# Altium schematic sheet ZooidPeripherals.SchDoc
size A4
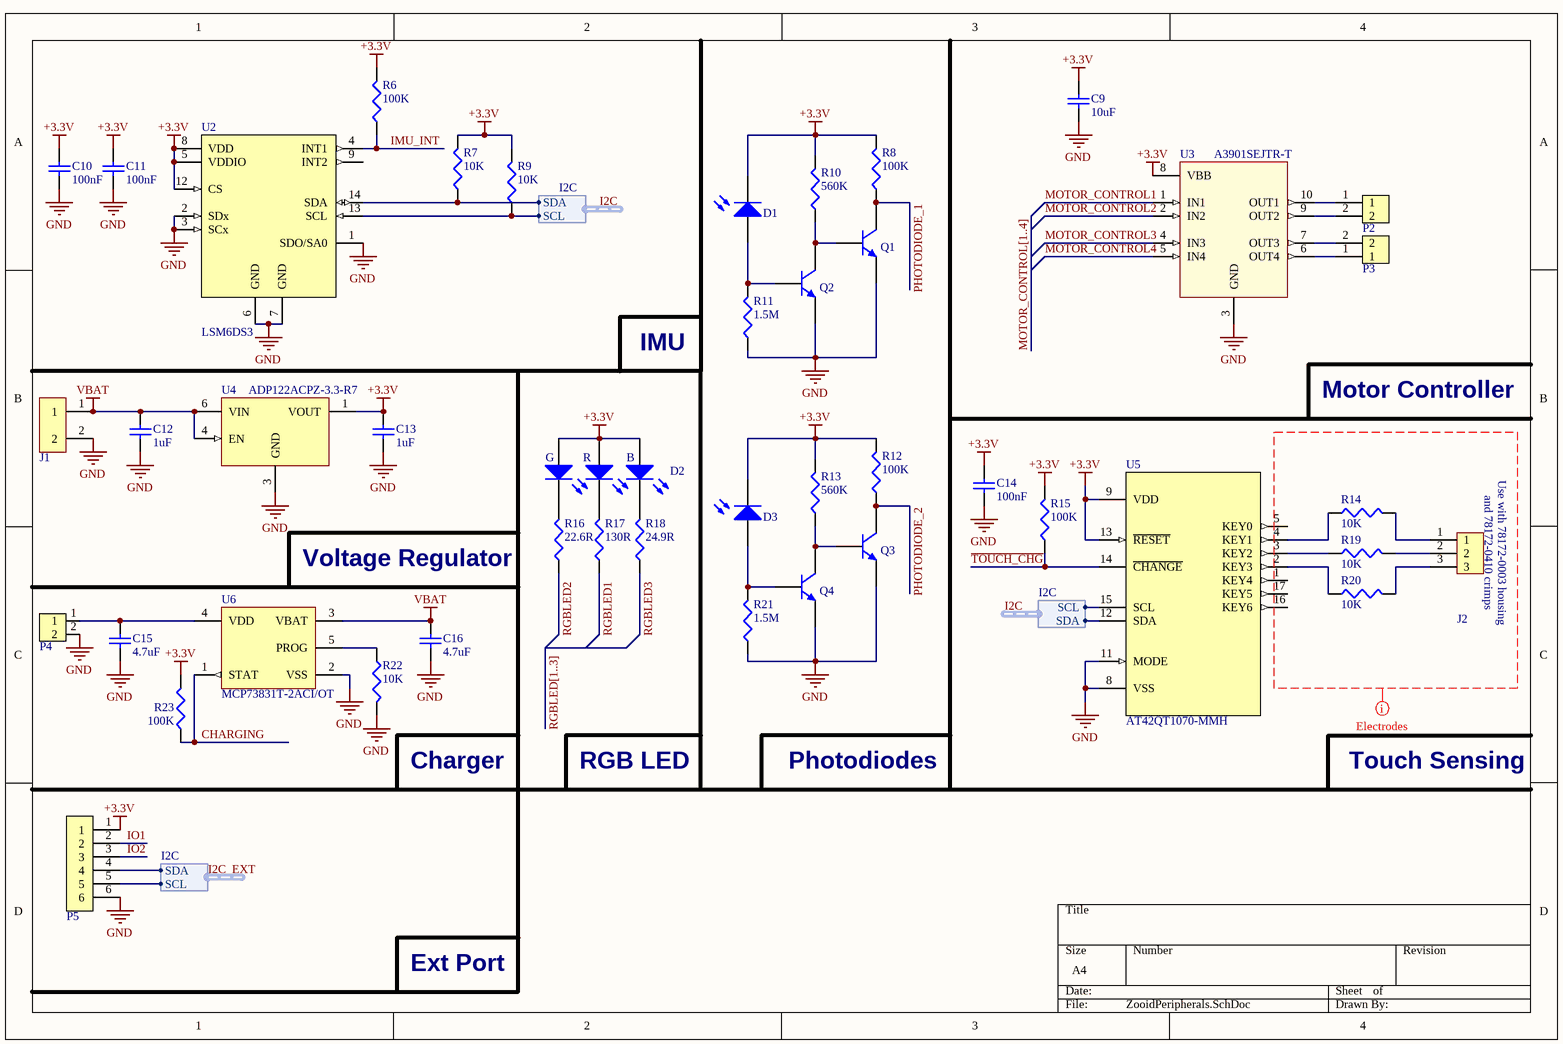
[diagram p0: ZooidPeripherals.SchDoc]

## Parts
C9  10uF  [0603]
C10  100nF  [0402]
C11  100nF  [0402]
C12  1uF  [0603]
C13  1uF  [0603]
C14  100nF  [0402]
C15  4.7uF  [0603]
C16  4.7uF  [0603]
D1  PD15-22C/TR8  [PD15-22C/TR8]  (value not drawn)
D2  SMLVN6RGB1W1  [3.5x2.8 mm 6-SMD]  (value not drawn)
D3  PD15-22C/TR8  [PD15-22C/TR8]  (value not drawn)
J1  78171-0002  [78171-0002]  (value not drawn)
J2  78171-0003  [78171-0003]  (value not drawn)
P2  HEADER 2X1 0.05" UNPOLARIZED  [HEADER 2X1 0.05" - UNPOLARIZED]  (value not drawn)
P3  HEADER 2X1 0.05" UNPOLARIZED  [HEADER 2X1 0.05" - UNPOLARIZED]  (value not drawn)
P4  CHARGING PAD  [Charging Pad]  (value not drawn)
P5  EXTENSION_PORT  [EXTENSION_PORT]  (value not drawn)
Q1  MMBT3904L  [SOT23_L]  (value not drawn)
Q2  MMBT3904L  [SOT23_L]  (value not drawn)
Q3  MMBT3904L  [SOT23_L]  (value not drawn)
Q4  MMBT3904L  [SOT23_L]  (value not drawn)
R6  100K  [0402]
R7  10K  [0402]
R8  100K  [0402]
R9  10K  [0402]
R10  560K  [0402]
R11  1.5M  [0402]
R12  100K  [0402]
R13  560K  [0402]
R14  10K  [0402]
R15  100K  [0402]
R16  22.6R  [0402]
R17  130R  [0402]
R18  24.9R  [0402]
R19  10K  [0402]
R20  10K  [0402]
R21  1.5M  [0402]
R22  10K  [0402]
R23  100K  [0402]
U2  LSM6DS3  [LGA-14 2.5x3x0.86 mm 14L]
U3  A3901SEJTR-T  [DFN50P300X300X75_HS-11N]
U4  ADP122ACPZ-3.3-R7  [LFCSP-6 2.0X2.0X0.55]
U5  AT42QT1070-MMH  [QFN45P300X300X85_HS-21L]
U6  MCP73831T-2ACI/OT  [SOT-23-OT5_L]

## Harnesses
I2C: SDA, SCL

## Nets
+3.3V: C9.2 C10.2 C11.2 C13.2 C14.2 D1.2(K) D2.1(AB) D2.2(AR) D2.3(AG) D3.2(K) P5.1 R6.2 R7.2 R8.2 R9.2 R10.2 R12.2 R13.2 R15.2 R23.2 U2.5(VDDIO) U2.8(VDD) U2.12(CS) U3.8(VBB) U4.1(VOUT) U5.9(VDD) U5.13(~{RESET})
GND: C9.1 C10.1 C11.1 C12.1 C13.1 C14.1 C15.1 C16.1 J1.2 P4.2 P5.6 Q1.2(E) Q2.2(E) Q3.2(E) Q4.2(E) R11.1 R21.1 R22.2 U2.1(SDO/SA0) U2.2(SDx) U2.3(SCx) U2.6(GND) U2.7(GND) U3.3(GND) U3.11(PAD) U4.2(NC) U4.3(GND) U4.5(NC) U4.7(THPAD) U5.8(VSS) U5.11(MODE) U5.21(PAD) U6.2(VSS)
VBAT: C12.2 C16.2 J1.1 U4.4(EN) U4.6(VIN) U6.3(VBAT)
CHARGING: R23.1 U6.1(STAT)
I2C.SCL: R9.1 U2.13(SCL) U5.15(SCL) ; harness I2C.SCL
I2C.SDA: R7.1 U2.14(SDA) U5.12(SDA) ; harness I2C.SDA
I2C_EXT.SCL: P5.5 ; harness I2C.SCL
I2C_EXT.SDA: P5.4 ; harness I2C.SDA
IMU_INT: R6.1 U2.4(INT1)
IO1: P5.2
IO2: P5.3
MOTOR_CONTROL1: U3.1(IN1)
MOTOR_CONTROL2: U3.2(IN2)
MOTOR_CONTROL3: U3.4(IN3)
MOTOR_CONTROL4: U3.5(IN4)
PHOTODIODE_1: Q1.3(C) R8.1
PHOTODIODE_2: Q3.3(C) R12.1
RGBLED1: R17.1
RGBLED2: R16.1
RGBLED3: R18.1
~{TOUCH_CHG}: R15.1 U5.14(~{CHANGE})
NetC15_2: C15.2 P4.1 U6.4(VDD)
NetD1_1: D1.1(A) Q2.1(B) R11.2
NetD2_4: D2.4(KG) R16.2
NetD2_5: D2.5(KR) R17.2
NetD2_6: D2.6(KB) R18.2
NetD3_1: D3.1(A) Q4.1(B) R21.2
NetJ2_1: J2.1 R14.2
NetJ2_2: J2.2 R19.2
NetJ2_3: J2.3 R20.2
NetP2_1: P2.1 U3.10(OUT1)
NetP2_2: P2.2 U3.9(OUT2)
NetP3_1: P3.1 U3.6(OUT4)
NetP3_2: P3.2 U3.7(OUT3)
NetQ1_1: Q1.1(B) Q2.3(C) R10.1
NetQ3_1: Q3.1(B) Q4.3(C) R13.1
NetR14_1: R14.1 U5.4(KEY1)
NetR19_1: R19.1 U5.3(KEY2)
NetR20_1: R20.1 U5.2(KEY3)
NetR22_1: R22.1 U6.5(PROG)

Not connected (* = marked no-connect by the designer): U2 9(INT2) 10(OCS) 11(NC); U5 1(KEY4) 5(KEY0) 6(NC) 7(NC) 10(NC) 16(KEY6) 17(KEY5) 18(NC) 19(NC) 20(NC)

## Buses and harness runs
bus MOTOR_CONTROL[1..4]
bus RGBLED[1..3]

## Layout directives
net class Electrodes: (no net found under the mark)

## Notes on the sheet
- IMU
- Motor Controller
- Voltage Regulator
- Charger
- RGB LED
- Photodiodes
- Touch Sensing
- Ext Port
- (in symbol 78171-0003) and 78172-0410 crimps; Use with 78172-0003 housing
- (in symbol SMLVN6RGB1W1) G; R; B

## Library data of the parts
C9 = 10uF: 10uF 0603 X5R 6.3V ±20%; Supplier 1: Farnell; Supplier Part Number 1: 2456110; Supplier 2: Digi-Key; Supplier Part Number 2: 490-10475-1-ND; Value: 10uF
C10 C11 C14 = 100nF: 100nF 0402 X7R 16V ±10%; Supplier 1: Farnell; Supplier Part Number 1: 1288252; Supplier 2: Digi-Key; Supplier Part Number 2: 399-3521-1-ND; Value: 100nF
C12 C13 = 1uF: 1uF 0603 X5R 10V ±10%; Supplier 1: Farnell; Supplier Part Number 1: 1759399; Supplier 2: Digi-Key; Supplier Part Number 2: 478-1251-1-ND; Value: 1uF
C15 C16 = 4.7uF: 4.7uF 0603 X5R 10V ±10%; Supplier 1: Farnell; Supplier Part Number 1: 2362098; Supplier 2: Digi-Key; Supplier Part Number 2: 445-5170-1-ND; Value: 4.7uF
D1 D3 = PD15-22C/TR8: Everlight PD15-22C/TR8 Silicon PIN Photodiode; Supplier 1: Digi-Key; Supplier Part Number 1: 1080-1367-1-ND
D2 = SMLVN6RGB1W1: ROHM SMLVN6RGB1W1 LED Tri-Color Blue/Green/Red Chip LED 6-Pin 1411 T/RLED Tri-Color Blue/Green/Red Chip LED 6-Pin 1411; Supplier 1: Mouser; Supplier 2: Digi-Key; Supplier Part Number 1: 755-SMLVN6RGB1W1; Supplier Part Number 2: 846-1187-1-ND
J1 = 78171-0002: Molex Pico-EZmate™ Wire-to-Board Header, 2 contacts; Supplier 1: Farnell; Supplier 2: Digi-Key; Supplier Part Number 1: 2313710; Supplier Part Number 2: WM4459CT-ND
J2 = 78171-0003: Molex Pico-EZmate™ Wire-to-Board Header, 3 contacts; Supplier 1: Farnell; Supplier 2: Digi-Key; Supplier Part Number 1: 2313562; Supplier Part Number 2: WM5409CT-ND
Q1-Q4 = MMBT3904L: On Semiconductor MMBT3904L General Purpose Transistor  NPN Silicon; Supplier 1: Farnell; Supplier 2: Digi-Key; Supplier Part Number 1: 1459100; Supplier Part Number 2: MMBT3904LT1GOSCT-ND
R6 R8 R12 R15 R23 = 100K: 100K 0402 1/16W ±1%; Supplier 1: Farnell; Supplier Part Number 1: 2072519; Supplier 2: Digi-Key; Supplier Part Number 2: 541-100KLCT-ND; Value: 100K
R7 R9 R14 R19 R20 R22 = 10K: 10K 0402 1/16W ±1%; Supplier 1: Farnell; Supplier Part Number 1: 2072517; Supplier 2: Digi-Key; Supplier Part Number 2: 541-10.0KLCT-ND; Value: 10K
R10 R13 = 560K: 560K 0402 1/16W ±1%; Supplier 1: Farnell; Supplier Part Number 1: 2074116; Supplier 2: Digi-Key; Supplier Part Number 2: 311-560KLRCT-ND; Value: 560K
R11 R21 = 1.5M: 1.5M 0402 1/16W ±1%; Supplier 1: Farnell; Supplier Part Number 1: 2141473; Supplier 2: Digi-Key; Supplier Part Number 2: 541-1.50MLCT-ND; Value: 1.5M
R16 = 22.6R: 22.6R 0402 1/16W ±0.05R; Supplier 1: Farnell; Supplier 2: Digi-Key; Supplier Part Number 1: 2302454; Supplier Part Number 2: P22.6LCT-ND; Value: 22.6R
R17 = 130R: 130R 0402 1/16W ±0.05R; Supplier 1: Farnell; Supplier 2: Digi-Key; Supplier Part Number 1: 2059115; Supplier Part Number 2: P130LCT-ND; Value: 130R
R18 = 24.9R: 24.9R 0402 1/16W ±0.05R; Supplier 1: Farnell; Supplier 2: Digi-Key; Supplier Part Number 1: 2059102; Supplier Part Number 2: P24.9LCT-ND; Value: 24.9R
U2 = LSM6DS3: STMicroelectronics iNEMO inertial module:   3D accelerometer and 3D gyroscope; Supplier 1: Farnell; Supplier Part Number 1: 2474253; Supplier 2: Digi-Key; Supplier Part Number 2: 497-15383-1-ND
U3 = A3901SEJTR-T: ALLEGRO MICROSYSTEMS - A3901SEJTR-T - IC, MOTOR DRIVER; Supplier 1: Farnell; Supplier 2: Digi-Key; Supplier Part Number 1: 1651947; Supplier Part Number 2: 620-1159-1-ND
U4 = ADP122ACPZ-3.3-R7: Analog Devices ADP122ACPZ-3.3-R7 - 5.5 V Input, 300 mA, Low Quiescent  Current, CMOS Linear Regulator; Supplier 1: Farnell; Supplier 2: Digi-Key; Supplier Part Number 1: 2457164; Supplier Part Number 2: ADP122ACPZ-3.3-R7CT-ND
U5 = AT42QT1070-MMH: Atmel Seven-channel QTouch® Touch Sensor IC; Supplier 1: Digi-Key; Supplier Part Number 1: AT42QT1070-MMHCT-ND
U6 = MCP73831T-2ACI/OT: Miniature Single-Cell, Fully Integrated Li-Ion, Li-Polymer Charge Management Controller, 4.2V, 5-Pin SOT-23, Industrial Temperature, Tape and Reel; Published: 29-Jan-2009; LatestRevisionDate: 27-Nov-2009; LatestRevisionNote: Updated to datasheet revision E, Sep-2008; DatasheetVersion: revE, Sep-2008; PackageVersion: revBB, Aug-2009; PackageReference: SOT-23-OT5; Publisher: Altium Limited; PackageDescription: 5-Lead Plastic Small Outline Transistor (OT) [SOT-23]; Supplier 1: Farnell; Supplier Part Number 1: 1332158; Code_IPC: SOT23-5; ComponentLink1Description: Datasheet; ComponentLink1URL: http://ww1.microchip.com/downloads/en/DeviceDoc/21984e.pdf; ComponentLink2Description: Packaging Specification; ComponentLink2URL: http://www.microchip.com/stellent/groups/techpub_sg/documents/packagingspec/en012702.pdf; ComponentLink3Description: Microchip.com Home; ComponentLink3URL: http://www.microchip.com/